# EasyEDA Pro project ProPrj_光电设计_2025-02-25.epro

# Schematic Schematic1
Board Name: Board1; Create Date: 2025-02-23; Page Name: P1; Project Name: 光电设计; Schematic Name: Schematic1; Update Date: 2025-02-24; Company: ECWorkship 电创坊; Page Size: A3; Version: V1.0
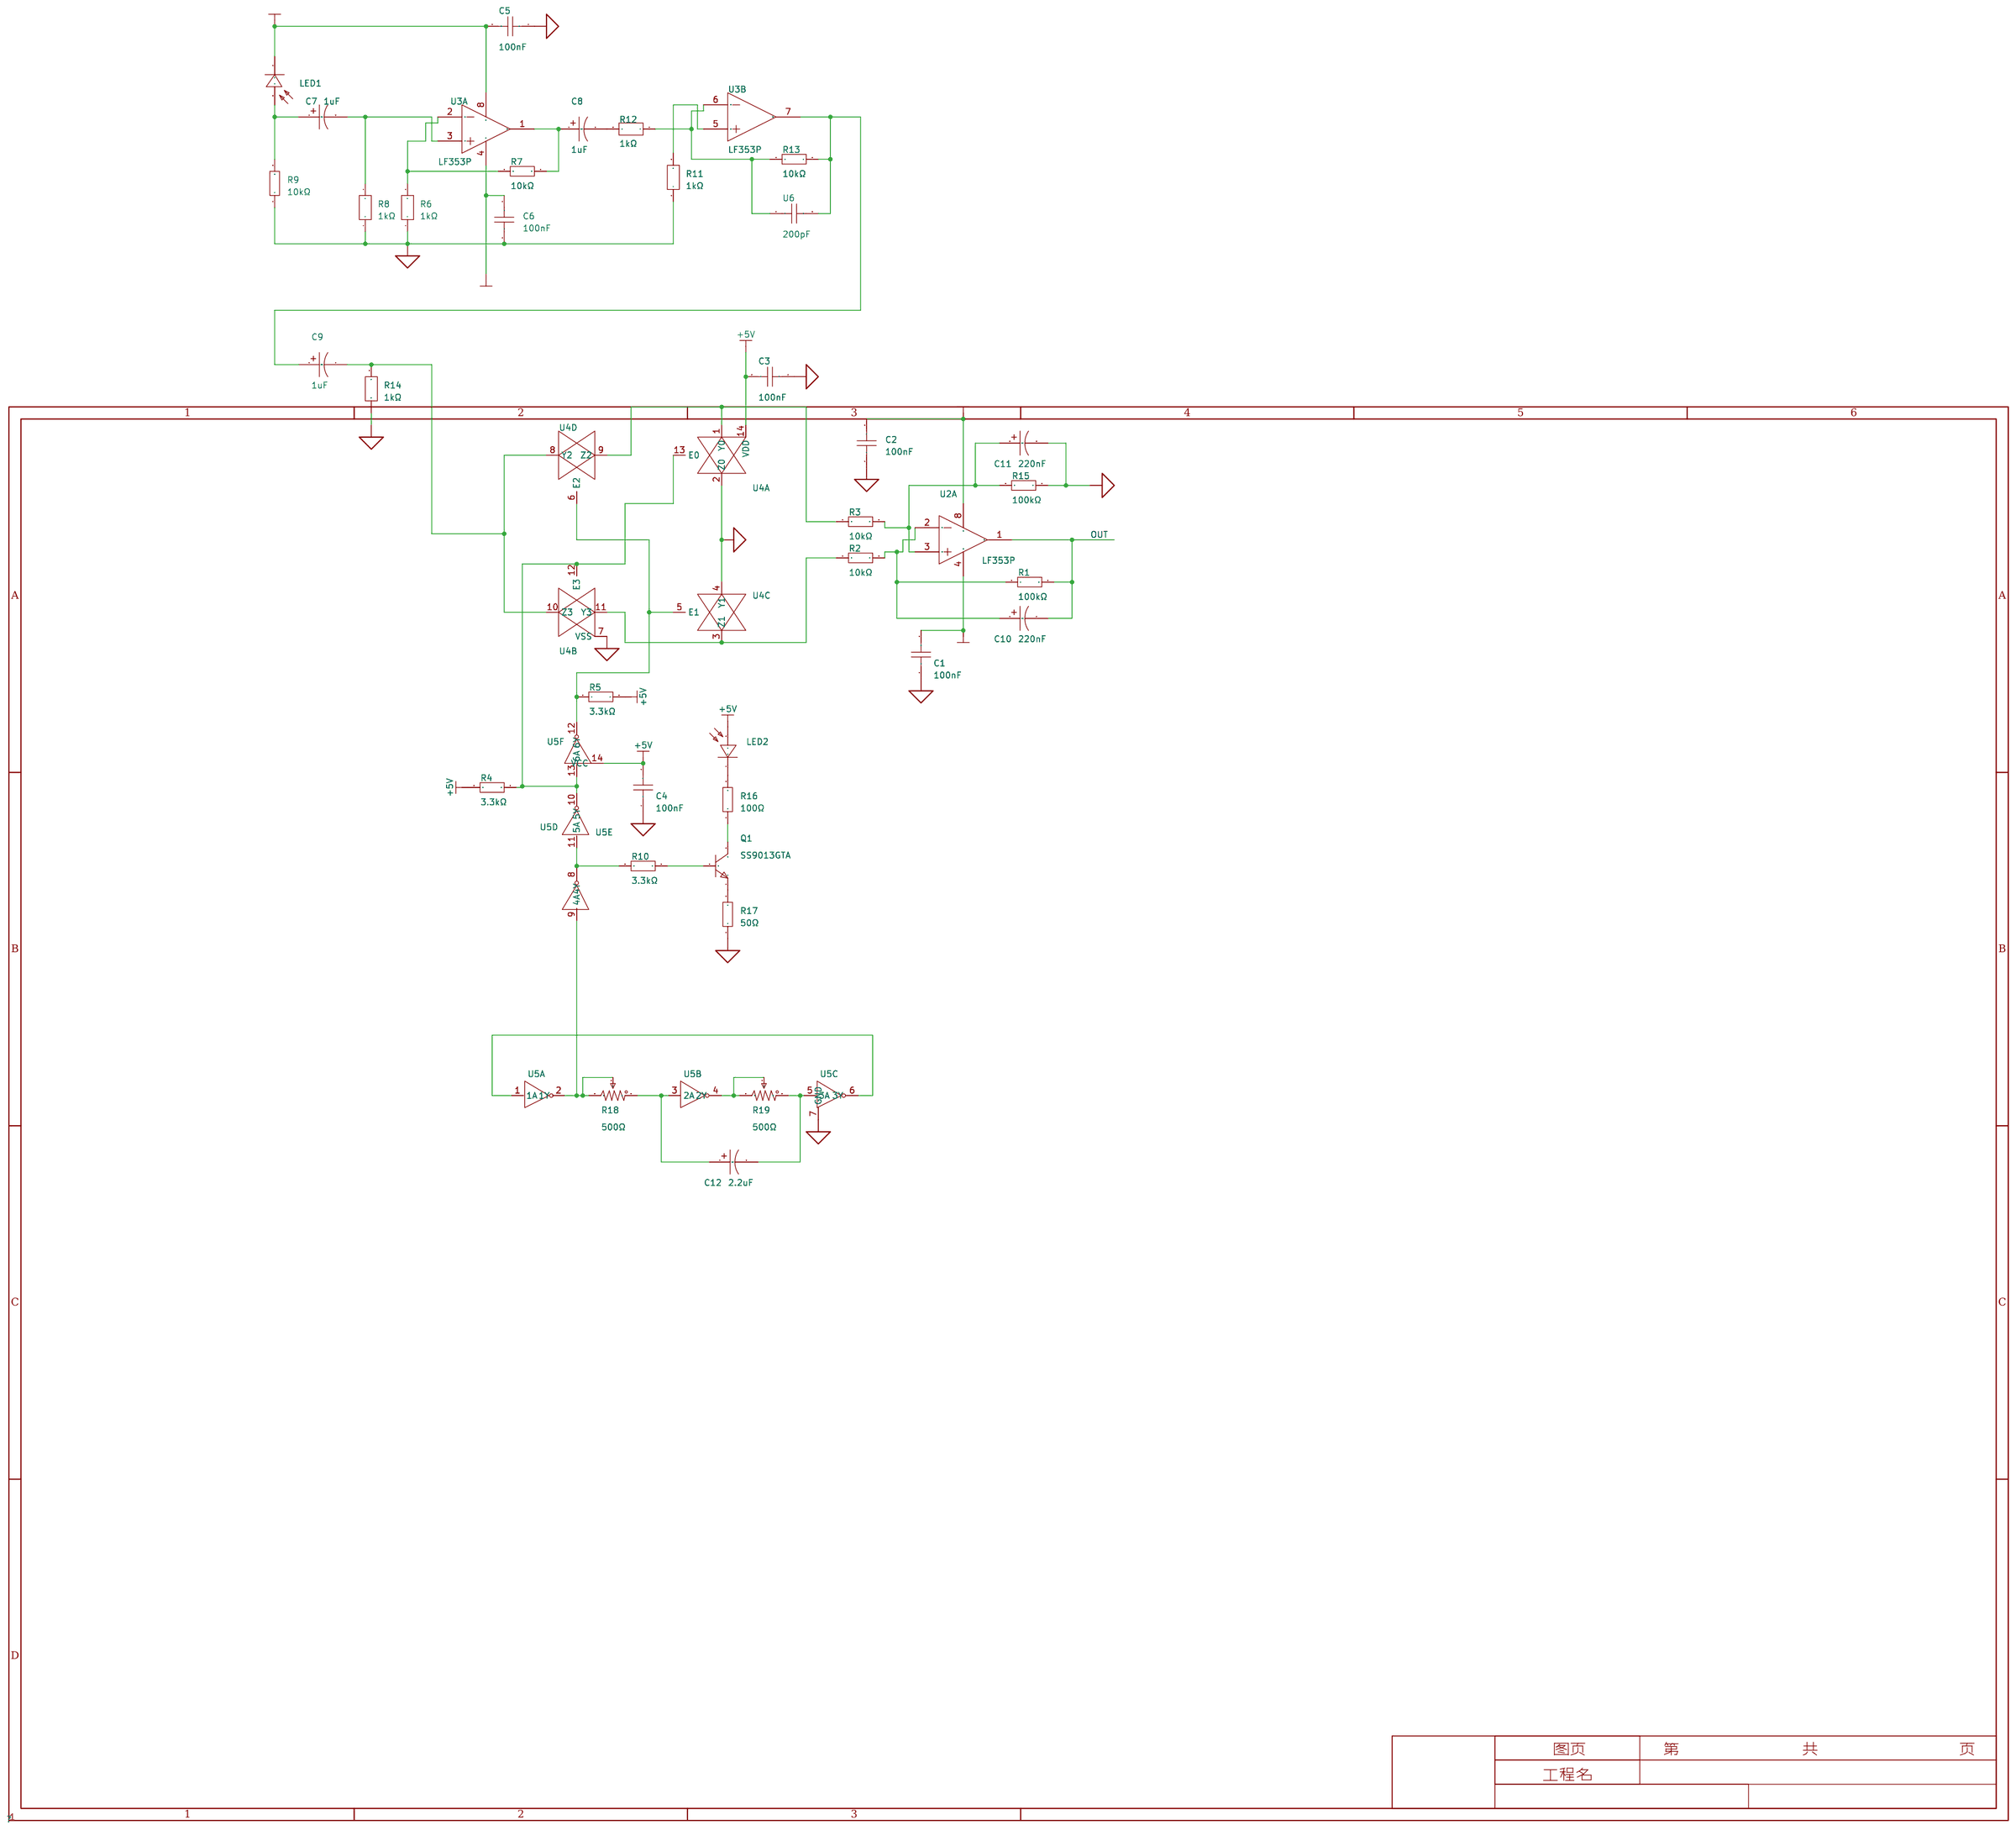
[diagram p0: schematic sheet]

## Parts
C1  100nF  [C0402]
C2  100nF  [C0402]
C3  100nF  [C0402]
C4  100nF  [C0402]
C5  100nF  [C0402]
C6  100nF  [C0402]
C7  1uF  [CAP-TH_BD5.0-P2.00-D0.5-FD-1]
C8  1uF  [CAP-TH_BD5.0-P2.00-D0.5-FD-1]
C9  1uF  [CAP-TH_BD5.0-P2.00-D0.5-FD-1]
C10  220nF  [CAP-TH_BD5.0-P2.00-D0.5-FD-1]
C11  220nF  [CAP-TH_BD5.0-P2.00-D0.5-FD-1]
C12  2.2uF  [CAP-TH_BD5.0-P2.00-D0.5-FD-1]
LED1  MHL560PD03BRT  [LED-TH_BD4.2-P2.54-RD]
LED2  MHL560PD03BRT  [LED-TH_BD4.2-P2.54-RD]
Q1  SS9013GTA  [TO-92-3_L4.8-W3.7-P1.27-L]
R1  100kΩ  [R0402]
R2  10kΩ  [R0402]
R3  10kΩ  [R0402]
R4  3.3kΩ  [R0402]
R5  3.3kΩ  [R0402]
R6  1kΩ  [R0402]
R7  10kΩ  [R0402]
R8  1kΩ  [R0402]
R9  10kΩ  [R0402]
R10  3.3kΩ  [R0402]
R11  1kΩ  [R0402]
R12  1kΩ  [R0402]
R13  10kΩ  [R0402]
R14  1kΩ  [R0402]
R15  100kΩ  [R0402]
R16  100Ω  [R0402]
R17  50Ω  [R0402]
R18  500Ω  [RES-ADJ-TH_3P-L10.0-W10.0-P2.50-L]
R19  500Ω  [RES-ADJ-TH_3P-L10.0-W10.0-P2.50-L]
U2  LF353P  [DIP-8_L10.1-W6.3-P2.54-LS7.6-BL]  (section 1)
U3  LF353P  [DIP-8_L10.1-W6.3-P2.54-LS7.6-BL]  (sections 1,2)
U4  CD4066BE  [DIP-14_L20.0-W7.6-P2.54-LS7.6-BL]  (sections 1,2,3,4)
U5  SN74HC04N(XBLW)  [DIP-14_L19.6-W6.4-P2.54-LS7.6-BL]  (sections 1,2,3,4,5,6)
U6  200pF  [C0402]

## Library data of the parts
C1-C6 = GRM155R71H104KE14D: 容值:100nF;精度:±10%;额定电压:50V;材质(温度系数):X7R;; LCSC Part Name: 100nF ±10% 50V; Supplier Part: C77020; Manufacturer: muRata(村田); Supplier Footprint: 0402; JLCPCB Part Class: 扩展库; Datasheet: https://atta.szlcsc.com/upload/public/pdf/source/20180326/C77020_39BD49C951FF1AF0DB1F1FAC5AC1E401.pdf; Supplier: LCSC; Tolerance: ±10%; Voltage Rated: 50V; Temperature Coefficient: X7R
C7-C12 = 50YXF1MEFC5X11: 容值:1uF;精度:±20%;额定电压:50V;纹波电流:-;等效串联电阻:-;; LCSC Part Name: 1uF ±20% 50V; Supplier Part: C2927584; Manufacturer: rubycon(红宝石); Supplier Footprint: 插件,D5xL11mm; JLCPCB Part Class: 扩展库; Datasheet: https://atta.szlcsc.com/upload/public/pdf/source/20190927/A608B204A99445D692775F6C1598BB1E_8CA00B2B77AF29A42B590F12C6538AC3.pdf; Supplier: LCSC; Tolerance: ±20%; Rated Voltage: 50V; Lead Spacing: 2mm; φD: 5mm; L: 11mm; Operating Temperature: -40℃~+105℃
LED1 LED2 = MHL560PD03BRT: 反向电压:30V;接收角:-;峰值波长:940nm;频谱范围:-;暗电流:5nA;; LCSC Part Name: F5红外接收二极管黑色PD940nm 反向电压30V; Supplier Part: C405264; Manufacturer: MEIHUA(美华); Supplier Footprint: 插件,D=5mm; JLCPCB Part Class: 扩展库; Datasheet: https://atta.szlcsc.com/upload/public/pdf/source/20191216/C405264_627BAC3D342CDA5902702107AA0D278C.pdf; Supplier: LCSC; DC Reverse Voltage: 30V; Peak  Wavelength: 940nm; Current Dark: 5nA; Operating Temperature: -35℃~+85℃
Q1 = SS9013GTA: 晶体管类型:NPN;集电极电流(Ic):500mA;集射极击穿电压(Vceo):20V;功率(Pd):625mW;直流电流增益(hFE@Ic,Vce):112@50mA,1V;; LCSC Part Name: NPN 电流:500mA 耐压:20V; Supplier Part: C3201701; Manufacturer: onsemi(安森美); Supplier Footprint: TO-92-3; JLCPCB Part Class: 扩展库; Datasheet: https://atta.szlcsc.com/upload/public/pdf/source/20230915/73B8B4FDD3DADB0AFC21569474619321.pdf; Supplier: LCSC; Transistor Type: NPN; Collector Current (Ic): 500mA; Collector-Emitter Breakdown Voltage (Vceo): 20V; Power Dissipation (Pd): 625mW; DC Current Gain (hFE@Ic,Vce): 112@50mA,1V; Collector Cut-Off Current (Icbo): 100nA; Collector-Emitter Saturation Voltage (VCE(sat)@Ic,Ib): 600mV@500mA,50mA
R1 R15 = RC0402FR-07100KL: 电阻类型:厚膜电阻;阻值:100kΩ;精度:±1%;功率:62.5mW;最大工作电压:50V;温度系数:±100ppm/℃;; LCSC Part Name: 厚膜电阻 100kΩ ±1% 62.5mW; Supplier Part: C60491; Manufacturer: YAGEO(国巨); Supplier Footprint: 0402; JLCPCB Part Class: 扩展库; Datasheet: https://atta.szlcsc.com/upload/public/pdf/source/20180927/C295883_E8D83085EA81BD7DE0B2B681138C15EE.pdf; Supplier: LCSC; Type: 厚膜电阻; Tolerance: ±1%; Power(Watts): 62.5mW; Overload Voltage (Max): 50V; Temperature Coefficient: ±100ppm/℃; Operating Temperature Range: -55℃~+155℃
R2 R3 R7 R9 R13 = RC0402FR-0710KL: 电阻类型:厚膜电阻;阻值:10kΩ;精度:±1%;功率:62.5mW;最大工作电压:50V;温度系数:±100ppm/℃;; LCSC Part Name: 厚膜电阻 10kΩ ±1% 62.5mW; Supplier Part: C60490; Manufacturer: YAGEO(国巨); Supplier Footprint: 0402; JLCPCB Part Class: 扩展库; Datasheet: https://atta.szlcsc.com/upload/public/pdf/source/20170925/C131467_1506321478108990263.pdf; Supplier: LCSC; Type: 厚膜电阻; Tolerance: ±1%; Power(Watts): 62.5mW; Overload Voltage (Max): 50V; Temperature Coefficient: ±100ppm/℃; Operating Temperature Range: -55℃~+155℃
R4 R5 R10 = RC0402FR-073K3L: 电阻类型:厚膜电阻;阻值:3.3kΩ;精度:±1%;功率:62.5mW;最大工作电压:50V;温度系数:±100ppm/℃;; LCSC Part Name: 厚膜电阻 3.3kΩ ±1% 62.5mW; Supplier Part: C137992; Manufacturer: YAGEO(国巨); Supplier Footprint: 0402; JLCPCB Part Class: 扩展库; Datasheet: https://atta.szlcsc.com/upload/public/pdf/source/20181009/C309620_DA5935B6E1D48212CB7A533FE518B3C2.pdf; Supplier: LCSC; Type: 厚膜电阻; Tolerance: ±1%; Power(Watts): 62.5mW; Overload Voltage (Max): 50V; Temperature Coefficient: ±100ppm/℃; Operating Temperature Range: -55℃~+155℃
R6 R8 R11 R12 R14 = RT0402BRD071KL: 电阻类型:薄膜电阻;阻值:1kΩ;精度:±0.1%;功率:62.5mW;最大工作电压:50V;温度系数:±25ppm/℃;; LCSC Part Name: 薄膜电阻 1kΩ ±0.1% 62.5mW; Supplier Part: C852624; Manufacturer: YAGEO(国巨); Supplier Footprint: 0402; JLCPCB Part Class: 扩展库; Datasheet: https://atta.szlcsc.com/upload/public/pdf/source/20210609/C852624_9EB141A274604F87C6BB037C8019D50A.pdf; Supplier: LCSC; Type: 薄膜电阻; Tolerance: ±0.1%; Power(Watts): 62.5mW; Overload Voltage (Max): 50V; Temperature Coefficient: ±25ppm/℃; Operating Temperature Range: -55℃~+155℃
R16 = 0402WGF1000TCE: 电阻类型:厚膜电阻;阻值:100Ω;精度:±1%;功率:62.5mW;最大工作电压:50V;温度系数:±200ppm/℃;; LCSC Part Name: 100Ω ±1% 62.5mW 厚膜电阻; Supplier Part: C25076; Manufacturer: UNI-ROYAL(厚声); Supplier Footprint: 0402; JLCPCB Part Class: 基础库; Datasheet: https://atta.szlcsc.com/upload/public/pdf/source/20200306/C422600_1E6D84923E4A46A82E41ADD87F860B5C.pdf; Supplier: LCSC; Type: 厚膜电阻; Tolerance: ±1%; Power(Watts): 62.5mW; Overload Voltage (Max): 50V; Temperature Coefficient: ±200ppm/℃; Operating Temperature Range: -55℃~+155℃
R17 = RT0402BRE0750RL: 电阻类型:薄膜电阻;阻值:50Ω;精度:±0.1%;功率:62.5mW;温度系数:±50ppm/℃;; LCSC Part Name: 薄膜电阻 50Ω ±0.1% 62.5mW; Supplier Part: C853312; Manufacturer: YAGEO(国巨); Supplier Footprint: 0402; JLCPCB Part Class: 扩展库; Datasheet: https://atta.szlcsc.com/upload/public/pdf/source/20200610/C326738_5639A9F1B6EB6E4AE2197577D3456E7F.pdf; Supplier: LCSC; Type: 薄膜电阻; Tolerance: ±0.1%; Power(Watts): 62.5mW; Temperature Coefficient: ±50ppm/℃; Operating Temperature Range: -55℃~+155℃
R18 R19 = 3296W-1-103: 阻值:10kΩ;精度:±10%;; LCSC Part Name: 10kΩ ±10%; Supplier Part: C118954; Manufacturer: BOCHEN(博晨); Supplier Footprint: 插件; JLCPCB Part Class: 扩展库; Datasheet: https://atta.szlcsc.com/upload/public/pdf/source/20171114/C118954_15106326646611117443.pdf; Supplier: LCSC; Tolerance: ±10%
U2 U3 = LF353P: 增益带宽积(GBP):3MHz;输入偏置电流(Ib):50pA;输入失调电压(Vos):5mV;压摆率(SR):13V/us;; Supplier Part: C5207; Manufacturer: TI(德州仪器); Supplier Footprint: DIP-8; JLCPCB Part Class: 扩展库; Datasheet: http://www.ti.com/cn/lit/gpn/lf353; Supplier: LCSC; Gain Bandwidth Product(GBP): 3MHz; Current - Input Bias(Ib): 50pA; Voltage - Input Offset(Vos): 5mV; Slew Rate(SR): 13V/us; Supply Current Per Channel: 3.6mA; Operating Temperature: 0℃~+70℃
U4 = CD4066BE_C507158: 开关电路:单刀单掷(SPST);通道数:4;导通电阻(Ron@VCC):1.3kΩ;; LCSC Part Name: CMOS四路双边开关; Supplier Part: C507158; Manufacturer: HGSEMI(华冠); Supplier Footprint: DIP-14; JLCPCB Part Class: 扩展库; Datasheet: https://atta.szlcsc.com/upload/public/pdf/source/20211126/BD768E4FF67D893E226722C18E7B5DB6.pdf; Supplier: LCSC; Switch Circuit: 单刀单掷(SPST); Number of Channels: 4; Supply Voltage: 3V~18V; On-State Resistance (Max): 1.3kΩ; Operating Temperature: -40℃~+85℃
U5 = SN74HC04N(XBLW): 输入类型:施密特触发器;电源电压:2V~6V;供电电流(最大值):2uA;电路数:6;最大传播延迟(tpd):7ns;; LCSC Part Name: SN74HC04N; Supplier Part: C18723497; Manufacturer: XBLW(芯伯乐); Supplier Footprint: DIP-14; JLCPCB Part Class: 扩展库; Datasheet: https://atta.szlcsc.com/upload/public/pdf/source/20231019/14C525573E9DFE3A802EC2FA2CBF7DB1.pdf; Supplier: LCSC; Input Type: 施密特触发器; Supply Voltage(Single): 2V~6V; Supply Current (Max): 2uA; Number of Circuits: 6; Sink Current: 5.2mA; Source Current: 4mA; High level range (VIH): 2.4V; Low level range (VIL): 2.1V; High level range (VOH): 4.32V; Low level range (VOL): 150mV; Max Propagation Delay: 7ns; Operating Temperature: -40℃~+105℃
U6 = GRM1555C1H201JA01D: 容值:200pF;精度:±5%;额定电压:50V;材质(温度系数):C0G;; LCSC Part Name: 200pF ±5% 50V; Supplier Part: C701303; Manufacturer: muRata(村田); Supplier Footprint: 0402; JLCPCB Part Class: 扩展库; Datasheet: https://atta.szlcsc.com/upload/public/pdf/source/20200407/C503309_0211D99E6F86B2657E389DD3F8367252.pdf; Supplier: LCSC; Tolerance: ±5%; Voltage Rated: 50V; Temperature Coefficient: C0G

## Nets
+5V: C3.2 C4.2 LED2.2(A) R4.2 R5.2 U4.14(VDD) U5.14(VCC)
+12V: C2.2 C5.2 LED1.1(C) U2.8(VCC+) U3.8(VCC+)
-12V: C1.2 C6.1 U2.4(VCC-) U3.4(VCC-)
AGND: C1.1 C2.1 C3.1 C4.1 C5.1 C6.2 C11.2 R6.1 R8.1 R9.1 R11.1 R14.1 R15.2 R17.1 U4.2(Z0) U4.4(Y1) U4.7(VSS) U5.7(GND)
OUT: C10.2 R1.2 U2.1(1OUT)
Net-(C7-1): C7.1 LED1.2(A) R9.2
Net-(C7-2): C7.2 R8.2 U3.3(1IN+)
Net-(C8-1): C8.1 R7.2 U3.1(1OUT)
Net-(C8-2): C8.2 R12.2
Net-(C9-1): C9.1 R13.2 U3.7(2OUT) U6.2
Net-(C9-2): C9.2 R14.2 U4.8(Y2) U4.10(Z3)
Net-(C10-1): C10.1 R1.1 R2.2 U2.2(1IN-)
Net-(C11-1): C11.1 R3.2 R15.1 U2.3(1IN+)
Net-(C12-1): C12.1 R18.1 U5.3(2A)
Net-(C12-2): C12.2 R19.1 U5.5(3A)
Net-(LED2-1): LED2.1(C) R16.2
Net-(Q1-1): Q1.1(E) R17.2
Net-(Q1-2): Q1.2(B) R10.1
Net-(Q1-3): Q1.3(C) R16.1
Net-(R2-1): R2.1 U4.3(Z1) U4.11(Y3)
Net-(R3-1): R3.1 U4.1(Y0) U4.9(Z2)
Net-(R4-1): R4.1 U4.12(E3) U4.13(E0) U5.10(5Y) U5.13(6A)
Net-(R5-1): R5.1 U4.5(E1) U4.6(E2) U5.12(6Y)
Net-(R6-2): R6.2 R7.1 U3.2(1IN-)
Net-(R10-2): R10.2 U5.8(4Y) U5.11(5A)
Net-(R11-2): R11.2 U3.5(2IN+)
Net-(R12-1): R12.1 R13.1 U3.6(2IN-) U6.1
Net-(R18-2): R18.2 R18.3 U5.2(1Y) U5.9(4A)
Net-(R19-2): R19.2 R19.3 U5.4(2Y)
Net-(U5-1): U5.1(1A) U5.6(3Y)
